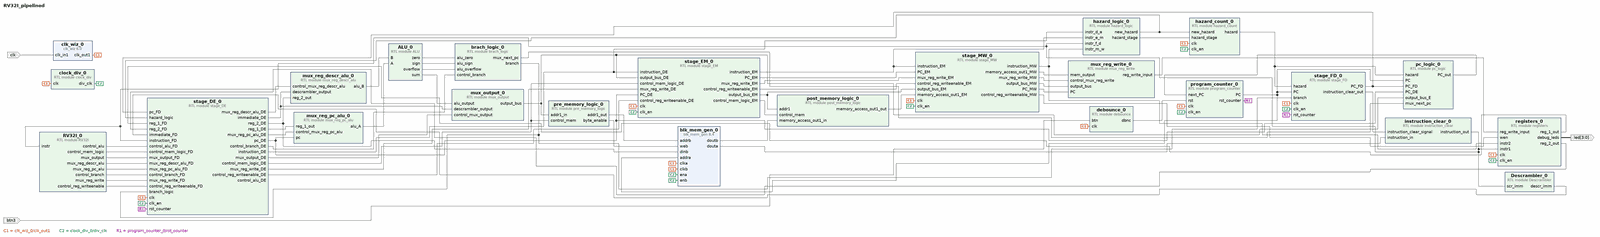
[diagram p0: block diagram of the top level, whole]
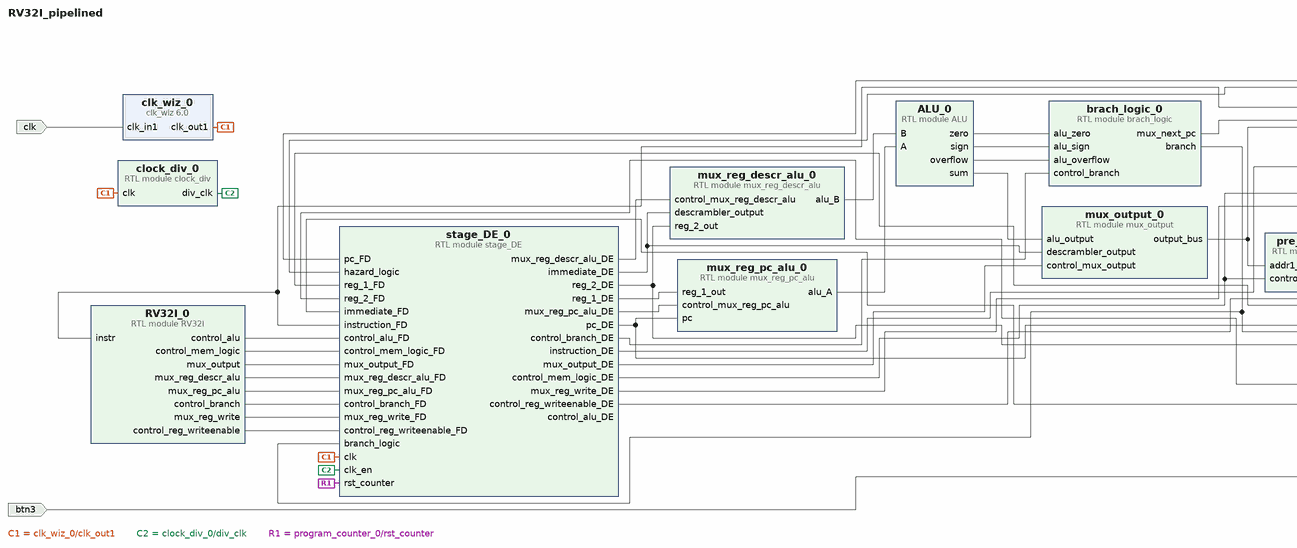
[diagram p1: block diagram of the top level, left part]
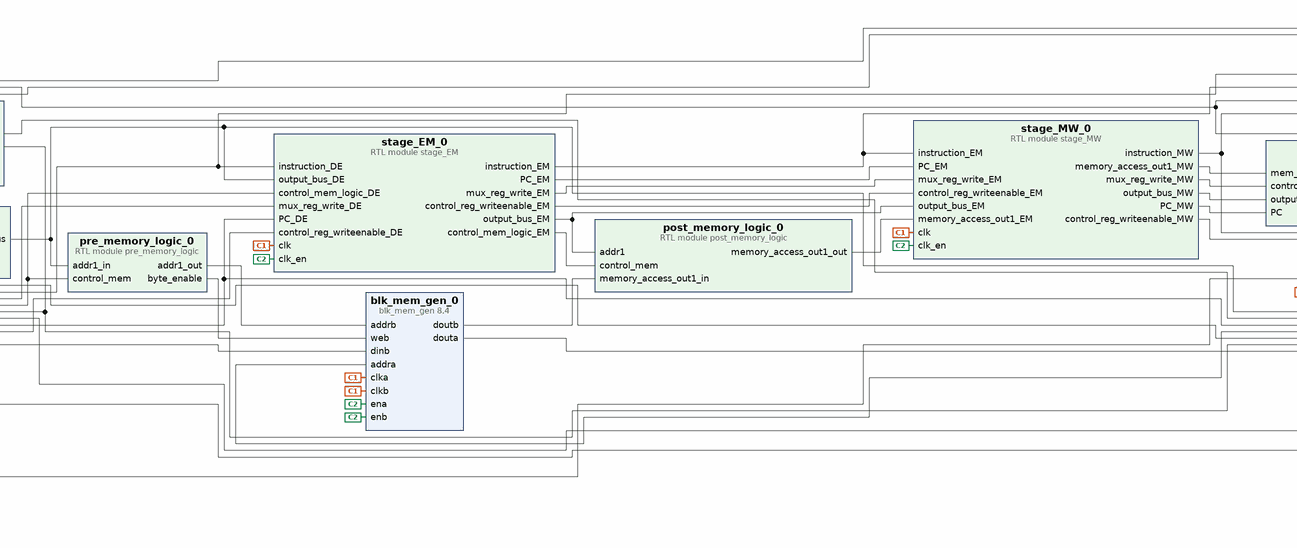
[diagram p2: block diagram of the top level, centre part]
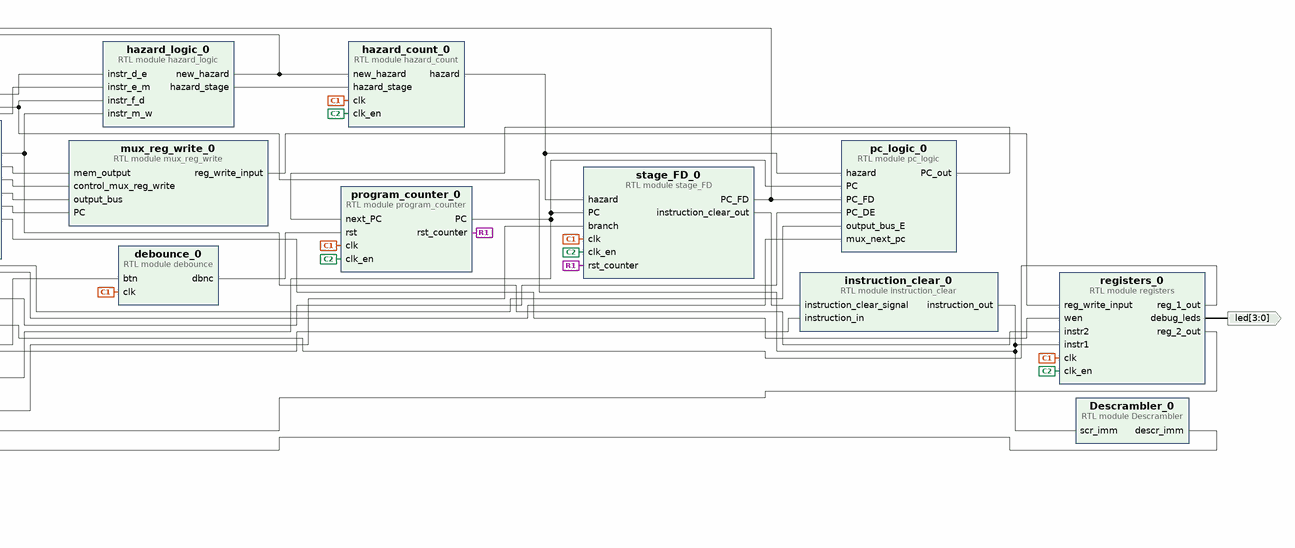
[diagram p3: block diagram of the top level, right part]
# Vivado block design RV32I_pipelined, xc7z010clg400-1, Vivado 2018.3
create_bd_design RV32I_pipelined

create_bd_port -dir I -type clk clk
set_property -dict {CONFIG.FREQ_HZ 125000000} [get_bd_ports clk]
create_bd_port -dir I -type rst btn3
create_bd_port -dir O -from 3 -to 0 led

create_bd_cell -type ip -vlnv xilinx.com:ip:blk_mem_gen:8.4 blk_mem_gen_0
set_property -dict [list \
  CONFIG.Assume_Synchronous_Clk false \
  CONFIG.Byte_Size 8 \
  CONFIG.Coe_File ../../../../imports/RISC-V-Processor/Dumps_and_Assembly/Dumps/addTest_Dump.coe \
  CONFIG.Enable_32bit_Address false \
  CONFIG.Enable_A Use_ENA_Pin \
  CONFIG.Enable_B Use_ENB_Pin \
  CONFIG.Fill_Remaining_Memory_Locations true \
  CONFIG.Load_Init_File true \
  CONFIG.Memory_Type True_Dual_Port_RAM \
  CONFIG.Port_B_Clock 100 \
  CONFIG.Port_B_Enable_Rate 100 \
  CONFIG.Port_B_Write_Rate 50 \
  CONFIG.Read_Width_A 32 \
  CONFIG.Read_Width_B 32 \
  CONFIG.Register_PortA_Output_of_Memory_Primitives false \
  CONFIG.Register_PortB_Output_of_Memory_Primitives false \
  CONFIG.Remaining_Memory_Locations 00000000 \
  CONFIG.Use_Byte_Write_Enable true \
  CONFIG.Use_RSTA_Pin false \
  CONFIG.Write_Depth_A 4096 \
  CONFIG.Write_Width_A 32 \
  CONFIG.Write_Width_B 32 \
  CONFIG.use_bram_block Stand_Alone \
] [get_bd_cells blk_mem_gen_0]
create_bd_cell -type module -reference registers registers_0
create_bd_cell -type ip -vlnv xilinx.com:ip:clk_wiz:6.0 clk_wiz_0
set_property -dict [list \
  CONFIG.CLKIN1_JITTER_PS 80.0 \
  CONFIG.CLKOUT1_DRIVES BUFG \
  CONFIG.CLKOUT1_JITTER 143.688 \
  CONFIG.CLKOUT1_PHASE_ERROR 96.948 \
  CONFIG.CLKOUT1_REQUESTED_OUT_FREQ 50.0 \
  CONFIG.CLKOUT2_DRIVES BUFG \
  CONFIG.CLKOUT2_JITTER 130.958 \
  CONFIG.CLKOUT2_PHASE_ERROR 98.575 \
  CONFIG.CLKOUT2_USED false \
  CONFIG.CLKOUT3_DRIVES BUFG \
  CONFIG.CLKOUT4_DRIVES BUFG \
  CONFIG.CLKOUT5_DRIVES BUFG \
  CONFIG.CLKOUT6_DRIVES BUFG \
  CONFIG.CLKOUT7_DRIVES BUFG \
  CONFIG.FEEDBACK_SOURCE FDBK_AUTO \
  CONFIG.MMCM_CLKFBOUT_MULT_F 8.000 \
  CONFIG.MMCM_CLKIN1_PERIOD 8.000 \
  CONFIG.MMCM_CLKOUT0_DIVIDE_F 20.000 \
  CONFIG.MMCM_CLKOUT1_DIVIDE 1 \
  CONFIG.MMCM_COMPENSATION ZHOLD \
  CONFIG.MMCM_DIVCLK_DIVIDE 1 \
  CONFIG.NUM_OUT_CLKS 1 \
  CONFIG.PRIMITIVE MMCM \
  CONFIG.PRIM_IN_FREQ 125.000 \
  CONFIG.USE_LOCKED false \
  CONFIG.USE_RESET false \
] [get_bd_cells clk_wiz_0]
create_bd_cell -type module -reference mux_reg_descr_alu mux_reg_descr_alu_0
create_bd_cell -type module -reference mux_reg_pc_alu mux_reg_pc_alu_0
create_bd_cell -type module -reference pre_memory_logic pre_memory_logic_0
create_bd_cell -type module -reference mux_output mux_output_0
create_bd_cell -type module -reference post_memory_logic post_memory_logic_0
create_bd_cell -type module -reference mux_reg_write mux_reg_write_0
create_bd_cell -type module -reference brach_logic brach_logic_0
create_bd_cell -type module -reference hazard_logic hazard_logic_0
create_bd_cell -type module -reference clock_div clock_div_0
create_bd_cell -type module -reference program_counter program_counter_0
create_bd_cell -type module -reference instruction_clear instruction_clear_0
create_bd_cell -type module -reference debounce debounce_0
create_bd_cell -type module -reference hazard_count hazard_count_0
create_bd_cell -type module -reference RV32I RV32I_0
create_bd_cell -type module -reference stage_FD stage_FD_0
create_bd_cell -type module -reference stage_EM stage_EM_0
create_bd_cell -type module -reference stage_DE stage_DE_0
create_bd_cell -type module -reference stage_MW stage_MW_0
create_bd_cell -type module -reference pc_logic pc_logic_0
create_bd_cell -type module -reference Descrambler Descrambler_0
create_bd_cell -type module -reference ALU ALU_0

# ---- connections ----

connect_bd_net -net clk_0_1 [get_bd_pins clk_wiz_0/clk_out1] \
  [get_bd_pins blk_mem_gen_0/clka] [get_bd_pins registers_0/clk] [get_bd_pins blk_mem_gen_0/clkb] \
  [get_bd_pins clock_div_0/clk] [get_bd_pins program_counter_0/clk] [get_bd_pins debounce_0/clk] \
  [get_bd_pins hazard_count_0/clk] [get_bd_pins stage_FD_0/clk] [get_bd_pins stage_EM_0/clk] [get_bd_pins stage_DE_0/clk] \
  [get_bd_pins stage_MW_0/clk]
connect_bd_net [get_bd_pins clock_div_0/div_clk] \
  [get_bd_pins blk_mem_gen_0/ena] [get_bd_pins registers_0/clk_en] [get_bd_pins blk_mem_gen_0/enb] \
  [get_bd_pins program_counter_0/clk_en] [get_bd_pins hazard_count_0/clk_en] [get_bd_pins stage_FD_0/clk_en] \
  [get_bd_pins stage_EM_0/clk_en] [get_bd_pins stage_DE_0/clk_en] [get_bd_pins stage_MW_0/clk_en]
connect_bd_net [get_bd_pins stage_FD_0/PC_FD] [get_bd_pins stage_DE_0/pc_FD] [get_bd_pins pc_logic_0/PC_FD]
connect_bd_net [get_bd_pins pc_logic_0/PC_out] [get_bd_pins program_counter_0/next_PC]
connect_bd_net -net blk_mem_gen_0_douta [get_bd_pins instruction_clear_0/instruction_out] \
  [get_bd_pins registers_0/instr1] [get_bd_pins hazard_logic_0/instr_f_d] [get_bd_pins RV32I_0/instr] \
  [get_bd_pins stage_DE_0/instruction_FD] [get_bd_pins Descrambler_0/scr_imm]
connect_bd_net [get_bd_pins hazard_logic_0/new_hazard] [get_bd_pins hazard_count_0/new_hazard] [get_bd_pins stage_DE_0/hazard_logic]
connect_bd_net [get_bd_pins hazard_logic_0/hazard_stage] [get_bd_pins hazard_count_0/hazard_stage]
connect_bd_net -net hazard_shift_counter_0_hazard [get_bd_pins hazard_count_0/hazard] [get_bd_pins stage_FD_0/hazard] [get_bd_pins pc_logic_0/hazard]
connect_bd_net [get_bd_pins registers_0/reg_1_out] [get_bd_pins stage_DE_0/reg_1_FD]
connect_bd_net [get_bd_pins registers_0/reg_2_out] [get_bd_pins stage_DE_0/reg_2_FD]
connect_bd_net [get_bd_pins Descrambler_0/descr_imm] [get_bd_pins stage_DE_0/immediate_FD]
connect_bd_net [get_bd_pins registers_0/debug_leds] [get_bd_ports led]
connect_bd_net [get_bd_pins RV32I_0/control_alu] [get_bd_pins stage_DE_0/control_alu_FD]
connect_bd_net [get_bd_pins RV32I_0/control_mem_logic] [get_bd_pins stage_DE_0/control_mem_logic_FD]
connect_bd_net [get_bd_pins RV32I_0/mux_output] [get_bd_pins stage_DE_0/mux_output_FD]
connect_bd_net [get_bd_pins RV32I_0/mux_reg_descr_alu] [get_bd_pins stage_DE_0/mux_reg_descr_alu_FD]
connect_bd_net [get_bd_pins RV32I_0/mux_reg_pc_alu] [get_bd_pins stage_DE_0/mux_reg_pc_alu_FD]
connect_bd_net [get_bd_pins RV32I_0/control_branch] [get_bd_pins stage_DE_0/control_branch_FD]
connect_bd_net [get_bd_pins RV32I_0/mux_reg_write] [get_bd_pins stage_DE_0/mux_reg_write_FD]
connect_bd_net [get_bd_pins RV32I_0/control_reg_writeenable] [get_bd_pins stage_DE_0/control_reg_writeenable_FD]
connect_bd_net [get_bd_pins stage_DE_0/instruction_DE] [get_bd_pins hazard_logic_0/instr_d_e] [get_bd_pins stage_EM_0/instruction_DE]
connect_bd_net [get_bd_pins stage_DE_0/immediate_DE] \
  [get_bd_pins mux_reg_descr_alu_0/descrambler_output] [get_bd_pins mux_output_0/descrambler_output]
connect_bd_net [get_bd_pins stage_DE_0/reg_2_DE] [get_bd_pins blk_mem_gen_0/dinb] [get_bd_pins mux_reg_descr_alu_0/reg_2_out]
connect_bd_net [get_bd_pins stage_DE_0/mux_reg_descr_alu_DE] [get_bd_pins mux_reg_descr_alu_0/control_mux_reg_descr_alu]
connect_bd_net [get_bd_pins stage_DE_0/reg_1_DE] [get_bd_pins mux_reg_pc_alu_0/reg_1_out]
connect_bd_net [get_bd_pins stage_DE_0/pc_DE] [get_bd_pins mux_reg_pc_alu_0/pc] [get_bd_pins stage_EM_0/PC_DE] [get_bd_pins pc_logic_0/PC_DE]
connect_bd_net [get_bd_pins stage_DE_0/mux_reg_pc_alu_DE] [get_bd_pins mux_reg_pc_alu_0/control_mux_reg_pc_alu]
connect_bd_net [get_bd_pins mux_reg_pc_alu_0/alu_A] [get_bd_pins ALU_0/A]
connect_bd_net [get_bd_pins mux_reg_descr_alu_0/alu_B] [get_bd_pins ALU_0/B]
# net stage_DE_0_control_alu_DE has one end: stage_DE_0/control_alu_DE
connect_bd_net [get_bd_pins ALU_0/sum] [get_bd_pins mux_output_0/alu_output]
connect_bd_net [get_bd_pins ALU_0/zero] [get_bd_pins brach_logic_0/alu_zero]
connect_bd_net [get_bd_pins ALU_0/sign] [get_bd_pins brach_logic_0/alu_sign]
connect_bd_net [get_bd_pins ALU_0/overflow] [get_bd_pins brach_logic_0/alu_overflow]
connect_bd_net [get_bd_pins stage_DE_0/control_branch_DE] [get_bd_pins brach_logic_0/control_branch]
connect_bd_net [get_bd_pins stage_DE_0/mux_output_DE] [get_bd_pins mux_output_0/control_mux_output]
connect_bd_net [get_bd_pins mux_output_0/output_bus] \
  [get_bd_pins pre_memory_logic_0/addr1_in] [get_bd_pins stage_EM_0/output_bus_DE] [get_bd_pins pc_logic_0/output_bus_E]
connect_bd_net [get_bd_pins stage_DE_0/control_mem_logic_DE] \
  [get_bd_pins pre_memory_logic_0/control_mem] [get_bd_pins stage_EM_0/control_mem_logic_DE]
connect_bd_net [get_bd_pins brach_logic_0/mux_next_pc] [get_bd_pins pc_logic_0/mux_next_pc]
connect_bd_net [get_bd_pins pre_memory_logic_0/addr1_out] [get_bd_pins blk_mem_gen_0/addrb]
connect_bd_net [get_bd_pins pre_memory_logic_0/byte_enable] [get_bd_pins blk_mem_gen_0/web]
connect_bd_net [get_bd_pins stage_DE_0/mux_reg_write_DE] [get_bd_pins stage_EM_0/mux_reg_write_DE]
connect_bd_net [get_bd_pins stage_DE_0/control_reg_writeenable_DE] [get_bd_pins stage_EM_0/control_reg_writeenable_DE]
connect_bd_net [get_bd_pins stage_EM_0/control_mem_logic_EM] [get_bd_pins post_memory_logic_0/control_mem]
connect_bd_net [get_bd_pins stage_EM_0/output_bus_EM] [get_bd_pins post_memory_logic_0/addr1] [get_bd_pins stage_MW_0/output_bus_EM]
connect_bd_net [get_bd_pins blk_mem_gen_0/doutb] [get_bd_pins post_memory_logic_0/memory_access_out1_in]
connect_bd_net [get_bd_pins stage_EM_0/instruction_EM] [get_bd_pins hazard_logic_0/instr_e_m] [get_bd_pins stage_MW_0/instruction_EM]
connect_bd_net [get_bd_pins stage_EM_0/PC_EM] [get_bd_pins stage_MW_0/PC_EM]
connect_bd_net [get_bd_pins stage_EM_0/mux_reg_write_EM] [get_bd_pins stage_MW_0/mux_reg_write_EM]
connect_bd_net [get_bd_pins stage_EM_0/control_reg_writeenable_EM] [get_bd_pins stage_MW_0/control_reg_writeenable_EM]
connect_bd_net [get_bd_pins post_memory_logic_0/memory_access_out1_out] [get_bd_pins stage_MW_0/memory_access_out1_EM]
connect_bd_net [get_bd_pins stage_MW_0/memory_access_out1_MW] [get_bd_pins mux_reg_write_0/mem_output]
connect_bd_net [get_bd_pins stage_MW_0/mux_reg_write_MW] [get_bd_pins mux_reg_write_0/control_mux_reg_write]
connect_bd_net [get_bd_pins stage_MW_0/output_bus_MW] [get_bd_pins mux_reg_write_0/output_bus]
connect_bd_net [get_bd_pins stage_MW_0/PC_MW] [get_bd_pins mux_reg_write_0/PC]
connect_bd_net [get_bd_pins mux_reg_write_0/reg_write_input] [get_bd_pins registers_0/reg_write_input]
connect_bd_net [get_bd_pins stage_MW_0/control_reg_writeenable_MW] [get_bd_pins registers_0/wen]
connect_bd_net [get_bd_pins stage_MW_0/instruction_MW] [get_bd_pins registers_0/instr2] [get_bd_pins hazard_logic_0/instr_m_w]
connect_bd_net [get_bd_pins stage_FD_0/instruction_clear_out] [get_bd_pins instruction_clear_0/instruction_clear_signal]
connect_bd_net [get_bd_pins blk_mem_gen_0/douta] [get_bd_pins instruction_clear_0/instruction_in]
connect_bd_net [get_bd_pins brach_logic_0/branch] [get_bd_pins stage_FD_0/branch] [get_bd_pins stage_DE_0/branch_logic]
connect_bd_net -net btn3_1 [get_bd_ports btn3] [get_bd_pins debounce_0/btn]
connect_bd_net [get_bd_pins debounce_0/dbnc] [get_bd_pins program_counter_0/rst]
connect_bd_net [get_bd_ports clk] [get_bd_pins clk_wiz_0/clk_in1]
connect_bd_net [get_bd_pins program_counter_0/PC] [get_bd_pins blk_mem_gen_0/addra] [get_bd_pins stage_FD_0/PC] [get_bd_pins pc_logic_0/PC]
connect_bd_net [get_bd_pins program_counter_0/rst_counter] [get_bd_pins stage_FD_0/rst_counter] [get_bd_pins stage_DE_0/rst_counter]

validate_bd_design
save_bd_design
